# Altium project MPU6050_Module_v2.PrjPcb
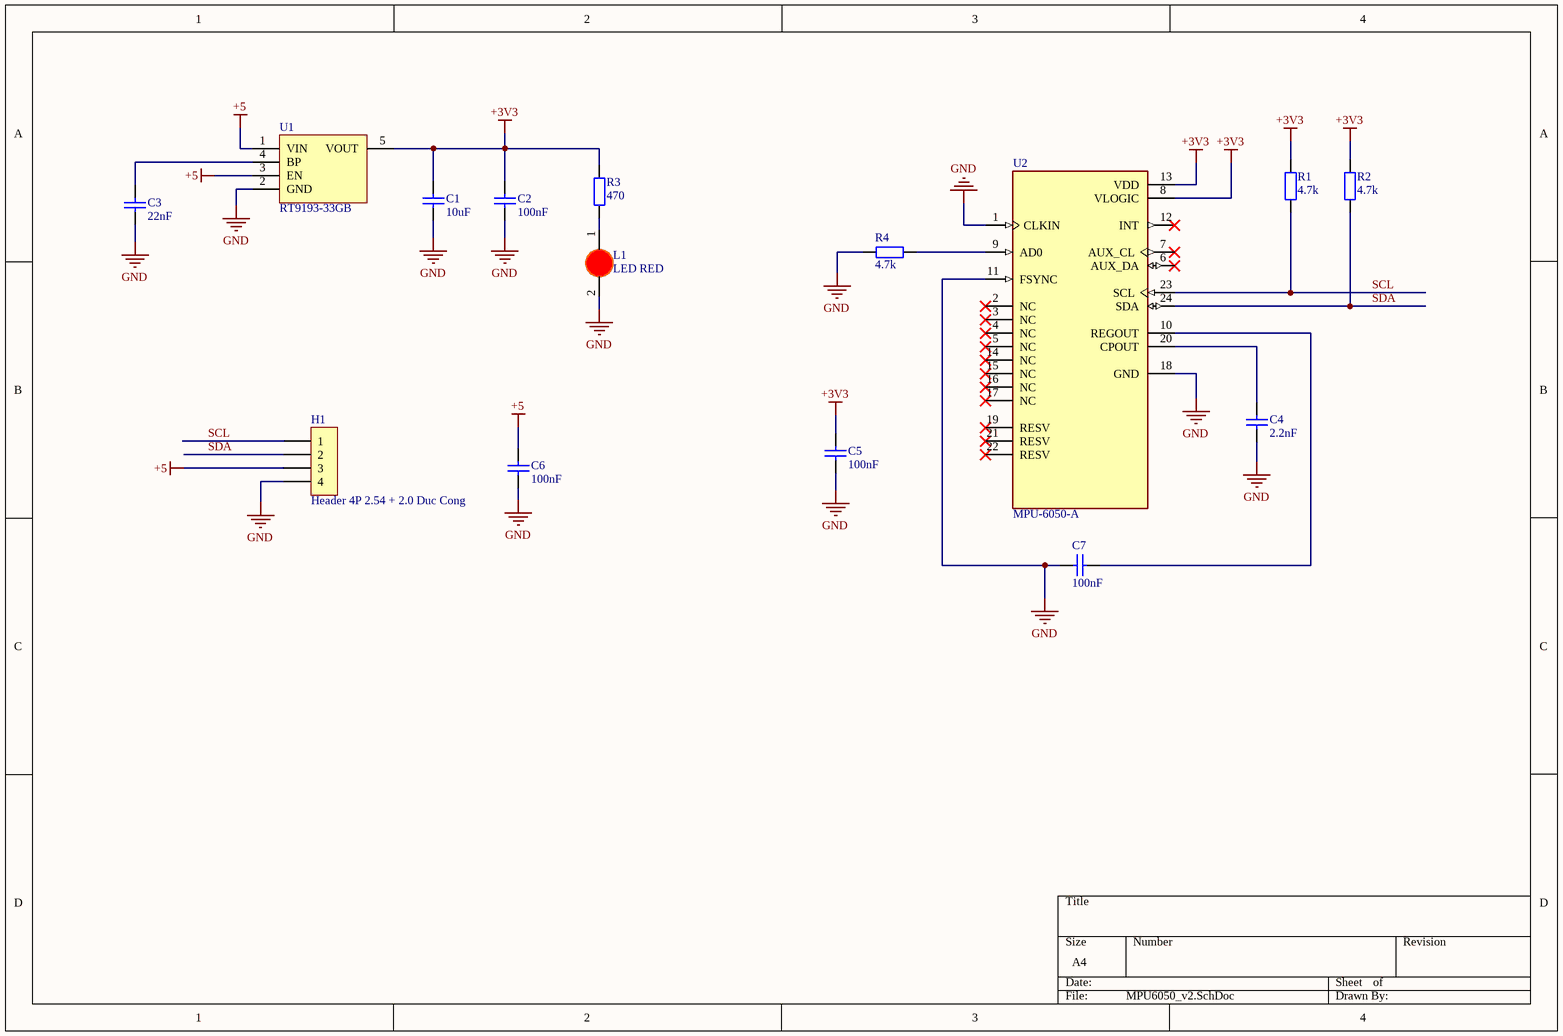
[diagram p0: MPU6050_v2.SchDoc]
1 sheet, 15 parts. Net scope: global (net labels, ports and power ports of the same name join across sheets).
Board file: MPU6050_v2_PCB.PcbDoc

## Sheet MPU6050_v2.SchDoc
size A4; SheetNumber: 1; SheetTotal: 1

### Parts
C1  10uF  [tu 0603]
C2  100nF  [tu 0603]
C3  22nF  [tu 0603]
C4  2.2nF  [tu 0603]
C5  100nF  [tu 0603]
C6  100nF  [tu 0603]
C7  100nF  [tu 0603]
H1  Header 4P 2.54 + 2.0 Duc Cong  [Header 4P DC 2.54 + 2.0]
L1  LED RED  [LED-0805-Red]
R1  4.7k  [tro smd 0603]
R2  4.7k  [tro smd 0603]
R3  470  [tro smd 0603]
R4  4.7k  [tro smd 0603]
U1  RT9193-33GB  [SOT23-5]
U2  MPU-6050-A  [QFN50P400X400X95-24N]

### Nets
+3V3: C1.1 C2.1 C5.1 R1.2 R2.2 R3.2 U1.5(VOUT) U2.8(VLOGIC) U2.13(VDD)
+5: C6.1 H1.3 U1.1(VIN) U1.3(EN)
GND: C1.2 C2.2 C3.2 C4.2 C5.2 C6.2 C7.1 H1.4 L1.2(K) R4.2 U1.2(GND) U2.1(CLKIN) U2.11(FSYNC) U2.18(GND)
SCL: H1.1 R1.1 U2.23(SCL)
SDA: H1.2 R2.1 U2.24(SDA)
NetC3_1: C3.1 U1.4(BP)
NetC4_1: C4.1 U2.20(CPOUT)
NetC7_2: C7.2 U2.10(REGOUT)
NetL1_1: L1.1(A) R3.1
NetR4_1: R4.1 U2.9(AD0)

Not connected (* = marked no-connect by the designer): U2 2(NC)* 3(NC)* 4(NC)* 5(NC)* 6(AUX_DA)* 7(AUX_CL)* 12(INT)* 14(NC)* 15(NC)* 16(NC)* 17(NC)* 19(RESV)* 21(RESV)* 22(RESV)*

### Library data of the parts
C1 = Tu 0603 106 16V 20%: Dán; Don_Vi: Con; So_Chan: 2; Ten_Linh_Kien: Tụ 0603-10uF 20% 16V; Ma_Hang: MH004848; Chung_Loai: Dán; Kieu_Chan: *
C2-C7 = Tu 0603 104 50V 10%: Dán; Don_Vi: Con; So_Chan: 2; Ten_Linh_Kien: Tụ 0603 104-100nF 10% 50V; Ma_Hang: MH004568; Chung_Loai: Dán; Kieu_Chan: *
H1 = Header 4P 2.54 + 2.0 Duc Cong: Cắm; Ten_Linh_Kien: Header 4P XH2.54-4P Đực Cong; Don_Vi: Con; Ma_Hang: MH001310; Chung_Loai: Cắm
L1 = LED 0805 Do: Dán; Don_Vi: Con; Ma_Hang: MH000897; Ten_Linh_Kien: LED 0805 Màu Đỏ (Red); Ghi_Chu: *; Kieu_Chan: *; Chung_Loai: Dán
R1 R2 R4 = Tro 0603 5% 4.7k: Dán; Don_Vi: Con; So_Chan: 2; Ten_Linh_Kien: Trở 0603 5% 4.7k; Ma_Hang: MH006327; Chung_Loai: Dán; Kieu_Chan: *
R3 = Tro 0603 1% 1k: Dán; So_Chan: 2; Don_Vi: Con; Ten_Linh_Kien: Trở 0603 1% 1k; Ma_Hang: MH006334; Chung_Loai: Dán; Kieu_Chan: *
U1 = REG_5.5V-3.3V-0.3A-1W-SOT-23-5: Linear Voltage Regulator IC 1 Output 300mA SOT-23-5; Manufacturer: Richtek USA Inc.; Alternate Part Number-1: NA; Manufacturer Part Number: RT9193-33GB; Supplier-1: LCSC; Supplier Part Number-1: C15651; Case/Package: SOT-23-5
U2 = MPU-6050-A: MF: TDK InvenSense; SnapEDA_Link: https://www.snapeda.com/parts/MPU-6050-A/InvenSense/view-part/?ref=snap; Package: None; Value: *; MP: MPU-6050-A; Check_prices: https://www.snapeda.com/parts/MPU-6050-A/InvenSense/view-part/?ref=eda